# EAGLE schematic Solenoid Driver (EAGLE 7.5.0)
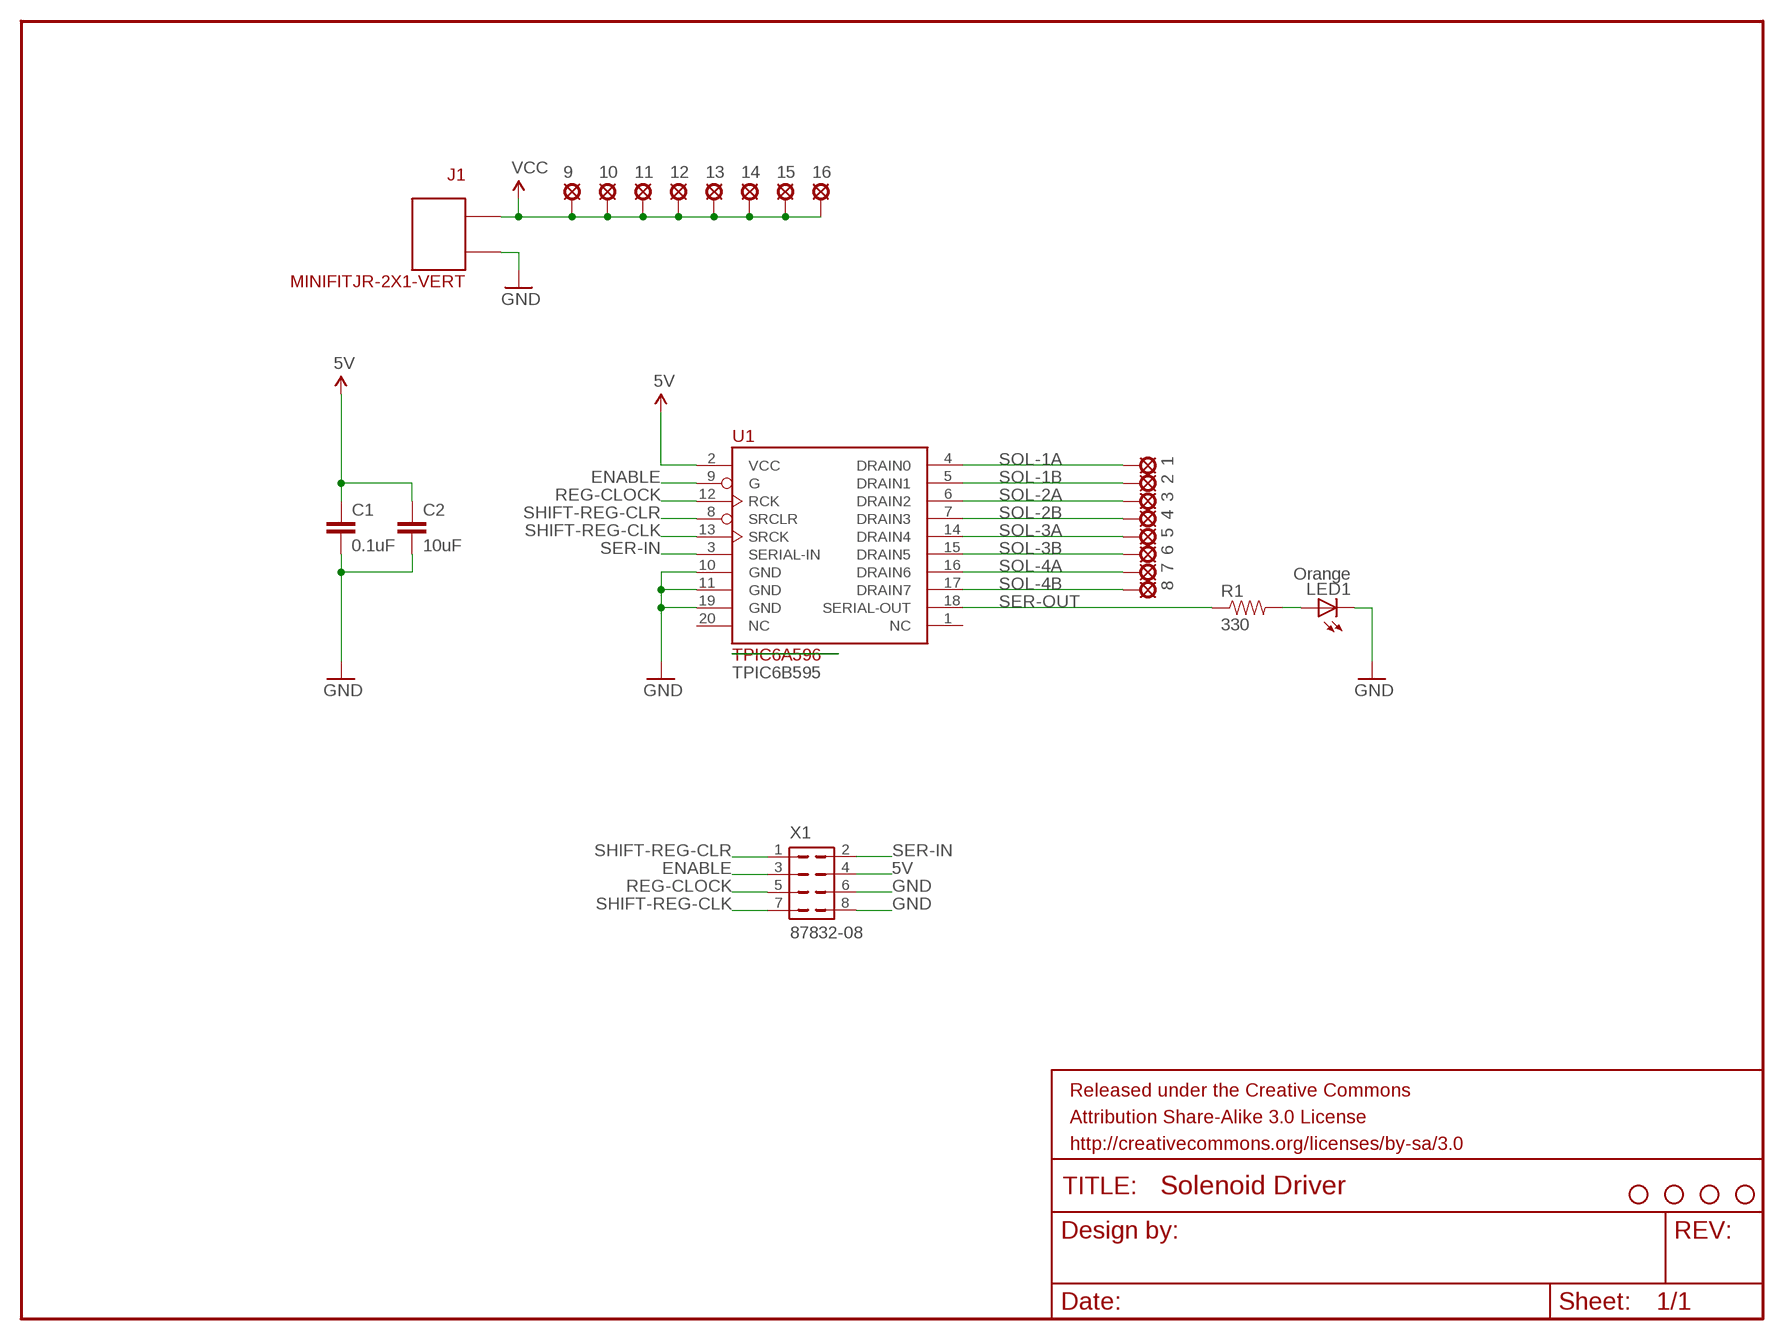
[diagram p0: schematic, sheet 1]

## Parts
1  SE14  [SE14]
2  SE14  [SE14]
3  SE14  [SE14]
4  SE14  [SE14]
5  SE14  [SE14]
6  SE14  [SE14]
7  SE14  [SE14]
8  SE14  [SE14]
9  SE14  [SE14]
10  SE14  [SE14]
11  SE14  [SE14]
12  SE14  [SE14]
13  SE14  [SE14]
14  SE14  [SE14]
15  SE14  [SE14]
16  SE14  [SE14]
C1  0.1uF  CAP0603-CAP  [0603-CAP]
C2  10uF  CAP0603-CAP  [0603-CAP]
J1  MINIFITJR-2X1-VERT  [5566-02B]
JP1  STAND-OFF  [STAND-OFF]
JP2  STAND-OFF  [STAND-OFF]
JP3  STAND-OFF  [STAND-OFF]
JP4  STAND-OFF  [STAND-OFF]
LED1  Orange  LED0603  [LED-0603]
R1  330  RESISTOR0603-RES  [0603-RES]
U1  TPIC6A596  [SOIC20-W]
X1  87832-08  [87832-08]

## Nets
5V: C1.1 C2.1 U1.2(VCC) X1.4
ENABLE: U1.9(G) X1.3
GND: C1.2 C2.2 J1.P$2 LED1.C U1.10(GND) U1.11(GND) U1.19(GND) X1.6 X1.8
N$1: LED1.A R1.2
REG-CLOCK: U1.12(RCK) X1.5
SER-IN: U1.3(SERIAL-IN) X1.2
SER-OUT: R1.1 U1.18(SERIAL-OUT)
SHIFT-REG-CLK: U1.13(SRCK) X1.7
SHIFT-REG-CLR: U1.8(SRCLR) X1.1
SOL-1A: 1.MP U1.4(DRAIN0)
SOL-1B: 2.MP U1.5(DRAIN1)
SOL-2A: 3.MP U1.6(DRAIN2)
SOL-2B: 4.MP U1.7(DRAIN3)
SOL-3A: 5.MP U1.14(DRAIN4)
SOL-3B: 6.MP U1.15(DRAIN5)
SOL-4A: 7.MP U1.16(DRAIN6)
SOL-4B: 8.MP U1.17(DRAIN7)
VCC: 9.MP 10.MP 11.MP 12.MP 13.MP 14.MP 15.MP 16.MP J1.P$1
Unconnected: U1.1(NC) U1.20(NC)

## Notes on the sheet
- TPIC6B595

## Library data of the parts
1-16 = solpad:SE14: SOLDER PAD E1553, drill 1,4mm, distributor Buerklin, 07F820
C1 C2 = SparkFun-Passives:CAP: Capacitor Standard 0603 ceramic capacitor, and 0.1" leaded capacitor.
J1 = Personal:MINIFITJR-2X1-VERT
JP1-JP4 = SparkFun-Electromechanical:STAND-OFF: #4 Stand Off This is the mechanical footprint for a #4 phillips button head screw. Use the keepout ring to avoid running the screw head into surrounding components. SKU : PRT-00447
LED1 = SparkFun-LED:LED: LEDs Standard schematic elements and footprints for 5mm, 3mm, 1206, and 0603 sized LEDs. 5mm - Spark Fun Electronics SKU : COM-00529 (and others)
R1 = SparkFun-Passives:RESISTOR: Resistor Basic schematic elements and footprints for 0603, 1206, and PTH resistors.
U1 = Personal:TPIC6A596
X1 = con-molex:87832-08: Milli-Grid Header 2.00mm (.079") Pitch; OC_FARNELL: unknown; OC_NEWARK: unknown